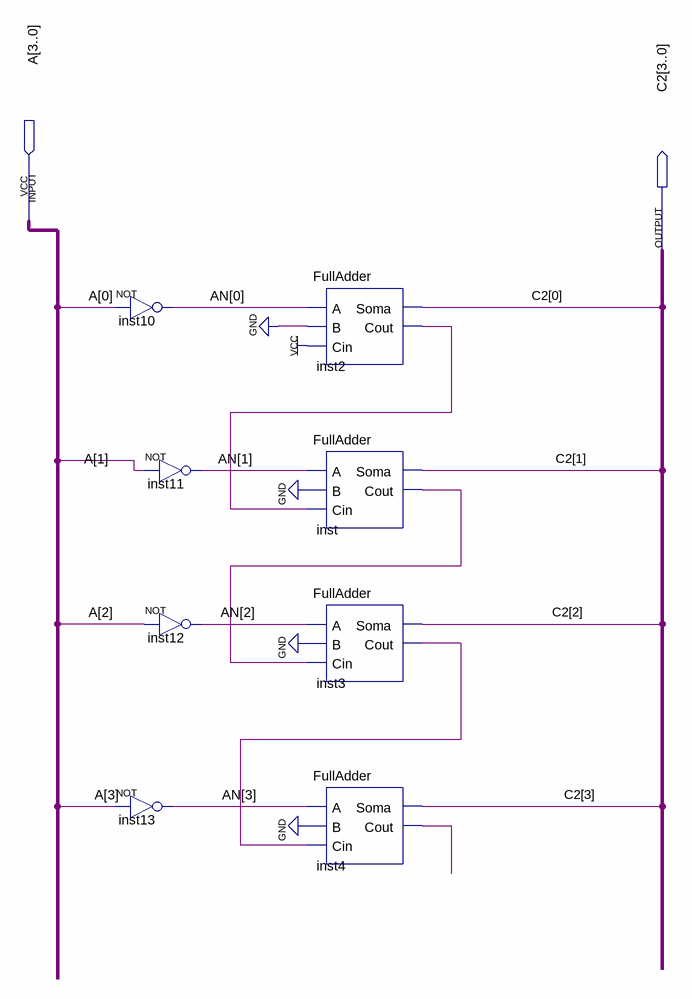
[diagram p0: schematic sheet]
// Quartus schematic C2_4Bits.bdf as structural Verilog: 8 symbols, 2 pins
module C2_4Bits (
  input  [3:0] A,
  output [3:0] C2
);

  wire inst2_cout, inst3_cout, inst4_cout, inst_cout;
  wire [3:0] AN;

  not inst10 (AN[0], A[0]);
  not inst11 (AN[1], A[1]);
  not inst12 (AN[2], A[2]);
  not inst13 (AN[3], A[3]);
  FullAdder inst2 (.A(AN[0]), .B(1'b0), .Cin(1'b1), .Soma(C2[0]), .Cout(inst2_cout));
  FullAdder inst (.A(AN[1]), .B(1'b0), .Cin(inst2_cout), .Soma(C2[1]), .Cout(inst_cout));
  FullAdder inst3 (.A(AN[2]), .B(1'b0), .Cin(inst_cout), .Soma(C2[2]), .Cout(inst3_cout));
  FullAdder inst4 (.A(AN[3]), .B(1'b0), .Cin(inst3_cout), .Soma(C2[3]), .Cout(inst4_cout));
endmodule
